# EAGLE design Controle_16_reles V2 (EAGLE 4.09)
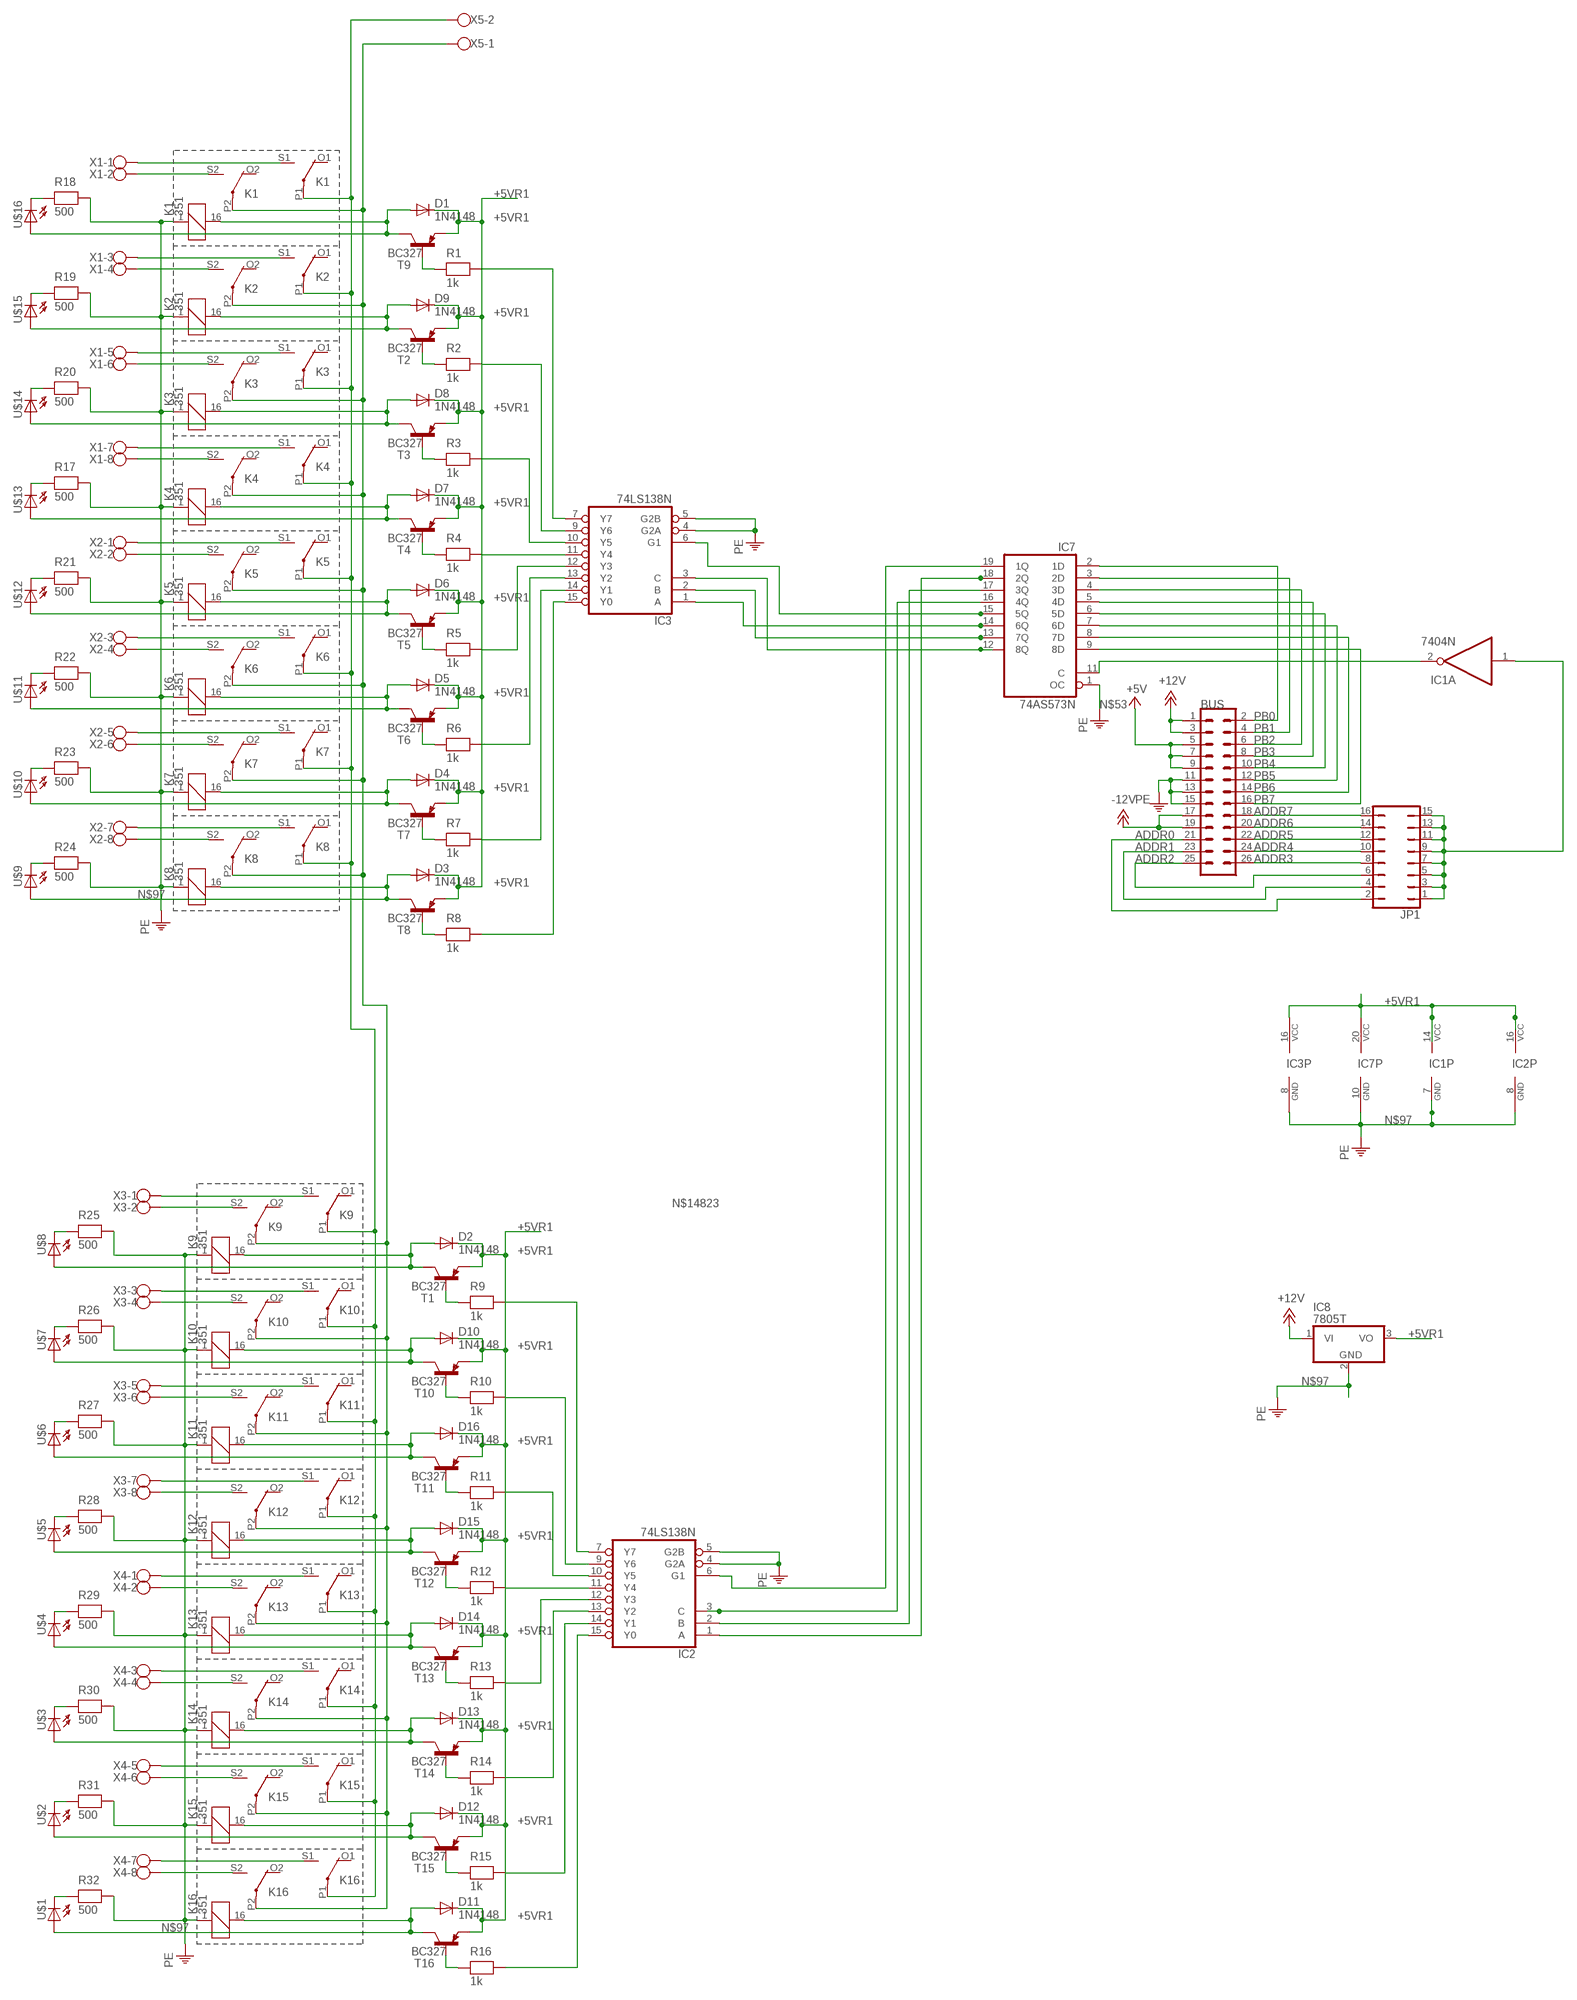
[diagram p0: schematic, sheet 1]

## Parts
BUS  ML26  [ML26]
D1  1N4148  [DO35-10]
D2  1N4148  [DO35-10]
D3  1N4148  [DO35-10]
D4  1N4148  [DO35-10]
D5  1N4148  [DO35-10]
D6  1N4148  [DO35-10]
D7  1N4148  [DO35-10]
D8  1N4148  [DO35-10]
D9  1N4148  [DO35-10]
D10  1N4148  [DO35-10]
D11  1N4148  [DO35-10]
D12  1N4148  [DO35-10]
D13  1N4148  [DO35-10]
D14  1N4148  [DO35-10]
D15  1N4148  [DO35-10]
D16  1N4148  [DO35-10]
IC1  7404N  [DIL14]
IC2  74LS138N  [DIL16]
IC3  74LS138N  [DIL16]
IC7  74AS573N  [DIL20]
IC8  7805T  [TO220H]
JP1  JP8Q  [JP8Q]
K1  351  [351]
K2  351  [351]
K3  351  [351]
K4  351  [351]
K5  351  [351]
K6  351  [351]
K7  351  [351]
K8  351  [351]
K9  351  [351]
K10  351  [351]
K11  351  [351]
K12  351  [351]
K13  351  [351]
K14  351  [351]
K15  351  [351]
K16  351  [351]
R1  1k  RESEU-10  [R-10]
R2  1k  RESEU-10  [R-10]
R3  1k  RESEU-10  [R-10]
R4  1k  RESEU-10  [R-10]
R5  1k  RESEU-10  [R-10]
R6  1k  RESEU-10  [R-10]
R7  1k  RESEU-10  [R-10]
R8  1k  RESEU-10  [R-10]
R9  1k  RESEU-10  [R-10]
R10  1k  RESEU-10  [R-10]
R11  1k  RESEU-10  [R-10]
R12  1k  RESEU-10  [R-10]
R13  1k  RESEU-10  [R-10]
R14  1k  RESEU-10  [R-10]
R15  1k  RESEU-10  [R-10]
R16  1k  RESEU-10  [R-10]
R17  500  RESEU-10  [R-10]
R18  500  RESEU-10  [R-10]
R19  500  RESEU-10  [R-10]
R20  500  RESEU-10  [R-10]
R21  500  RESEU-10  [R-10]
R22  500  RESEU-10  [R-10]
R23  500  RESEU-10  [R-10]
R24  500  RESEU-10  [R-10]
R25  500  RESEU-10  [R-10]
R26  500  RESEU-10  [R-10]
R27  500  RESEU-10  [R-10]
R28  500  RESEU-10  [R-10]
R29  500  RESEU-10  [R-10]
R30  500  RESEU-10  [R-10]
R31  500  RESEU-10  [R-10]
R32  500  RESEU-10  [R-10]
T1  BC327  [TO92]
T2  BC327  [TO92]
T3  BC327  [TO92]
T4  BC327  [TO92]
T5  BC327  [TO92]
T6  BC327  [TO92]
T7  BC327  [TO92]
T8  BC327  [TO92]
T9  BC327  [TO92]
T10  BC327  [TO92]
T11  BC327  [TO92]
T12  BC327  [TO92]
T13  BC327  [TO92]
T14  BC327  [TO92]
T15  BC327  [TO92]
T16  BC327  [TO92]
U$1  LED3MM  [LED3MM]
U$2  LED3MM  [LED3MM]
U$3  LED3MM  [LED3MM]
U$4  LED3MM  [LED3MM]
U$5  LED3MM  [LED3MM]
U$6  LED3MM  [LED3MM]
U$7  LED3MM  [LED3MM]
U$8  LED3MM  [LED3MM]
U$9  LED3MM  [LED3MM]
U$10  LED3MM  [LED3MM]
U$11  LED3MM  [LED3MM]
U$12  LED3MM  [LED3MM]
U$13  LED3MM  [LED3MM]
U$14  LED3MM  [LED3MM]
U$15  LED3MM  [LED3MM]
U$16  LED3MM  [LED3MM]
X1  AK500/8  [AK500/8]
X2  AK500/8  [AK500/8]
X3  AK500/8  [AK500/8]
X4  AK500/8  [AK500/8]
X5  AK300/2  [AK300/2]

## Nets
+5V: BUS.5 BUS.7 BUS.9
+5VR1: D1.C D2.C D3.C D4.C D5.C D6.C D7.C D8.C D9.C D10.C D11.C D12.C D13.C D14.C D15.C D16.C IC1.14(P:VCC) IC2.16(VCC) IC3.16(VCC) IC7.20(VCC) IC8.3(VO) T1.1(E) T2.1(E) T3.1(E) T4.1(E) T5.1(E) T6.1(E) T7.1(E) T8.1(E) T9.1(E) T10.1(E) T11.1(E) T12.1(E) T13.1(E) T14.1(E) T15.1(E) T16.1(E)
+12V: BUS.1 BUS.3 IC8.1(VI)
-12V: BUS.17 BUS.19
ADDR0: BUS.21 JP1.2
ADDR1: BUS.23 JP1.4
ADDR2: BUS.25 JP1.6
ADDR3: BUS.26 JP1.8
ADDR4: BUS.24 JP1.10
ADDR5: BUS.22 JP1.12
ADDR6: BUS.20 JP1.14
ADDR7: BUS.18 JP1.16
N$1: R9.1 T1.2(B)
N$2: R5.1 T5.2(B)
N$3: IC3.7(Y7) R1.2
N$4: IC3.9(Y6) R2.2
N$5: IC3.10(Y5) R3.2
N$6: IC3.11(Y4) R4.2
N$7: IC3.15(Y0) R8.2
N$8: IC3.14(Y1) R7.2
N$9: IC3.13(Y2) R6.2
N$10: R1.1 T9.2(B)
N$11: IC3.1(A) IC7.14(6Q)
N$12: IC3.2(B) IC7.13(7Q)
N$13: IC3.3(C) IC7.12(8Q)
N$14: IC3.6(G1) IC7.15(5Q)
N$15: D6.A K5.16 T5.3(C) U$12.A
N$16: IC2.3(C) IC7.16(4Q)
N$17: R2.1 T2.2(B)
N$18: D1.A K1.16 T9.3(C) U$16.A
N$19: D9.A K2.16 T2.3(C) U$15.A
N$20: R6.1 T6.2(B)
N$21: R3.1 T3.2(B)
N$22: D8.A K3.16 T3.3(C) U$14.A
N$23: D5.A K6.16 T6.3(C) U$11.A
N$24: R4.1 T4.2(B)
N$25: D7.A K4.16 T4.3(C) U$13.A
N$26: R7.1 T7.2(B)
N$27: D4.A K7.16 T7.3(C) U$10.A
N$28: R8.1 T8.2(B)
N$29: D3.A K8.16 T8.3(C) U$9.A
N$30: IC3.12(Y3) R5.2
N$32: IC2.2(B) IC7.17(3Q)
N$33: IC1.1(A:I) JP1.1 JP1.3 JP1.5 JP1.7 JP1.9 JP1.11 JP1.13 JP1.15
N$34: IC2.1(A) IC7.18(2Q)
N$35: K1.S1(2:S) X1.1
N$36: K1.S2(3:S) X1.2
N$37: K2.S1(2:S) X1.3
N$38: K2.S2(3:S) X1.4
N$39: K3.S1(2:S) X1.5
N$40: K3.S2(3:S) X1.6
N$41: K4.S1(2:S) X1.7
N$42: K4.S2(3:S) X1.8
N$43: K5.S1(2:S) X2.1
N$44: K5.S2(3:S) X2.2
N$45: K6.S1(2:S) X2.3
N$46: K6.S2(3:S) X2.4
N$47: K7.S1(2:S) X2.5
N$48: K7.S2(3:S) X2.6
N$49: K8.S1(2:S) X2.7
N$50: K8.S2(3:S) X2.8
N$51: R18.1 U$16.K(C)
N$52: D2.A K9.16 T1.3(C) U$8.A
N$53: IC1.2(A:O) IC7.11(C)
N$54: R10.1 T10.2(B)
N$55: D10.A K10.16 T10.3(C) U$7.A
N$56: R11.1 T11.2(B)
N$57: D16.A K11.16 T11.3(C) U$6.A
N$58: R12.1 T12.2(B)
N$60: D15.A K12.16 T12.3(C) U$5.A
N$61: R13.1 T13.2(B)
N$62: D14.A K13.16 T13.3(C) U$4.A
N$63: R14.1 T14.2(B)
N$64: D13.A K14.16 T14.3(C) U$3.A
N$65: R15.1 T15.2(B)
N$66: D12.A K15.16 T15.3(C) U$2.A
N$67: R16.1 T16.2(B)
N$68: D11.A K16.16 T16.3(C) U$1.A
N$69: IC2.7(Y7) R9.2
N$70: IC2.9(Y6) R10.2
N$71: IC2.10(Y5) R11.2
N$72: IC2.11(Y4) R12.2
N$73: IC2.15(Y0) R16.2
N$74: IC2.14(Y1) R15.2
N$75: IC2.13(Y2) R14.2
N$76: IC2.12(Y3) R13.2
N$77: IC2.6(G1) IC7.19(1Q)
N$78: K9.S1(2:S) X3.1
N$79: K9.S2(3:S) X3.2
N$80: K10.S1(2:S) X3.3
N$81: K10.S2(3:S) X3.4
N$82: K11.S1(2:S) X3.5
N$83: K11.S2(3:S) X3.6
N$84: K12.S1(2:S) X3.7
N$85: K12.S2(3:S) X3.8
N$86: K13.S1(2:S) X4.1
N$87: K13.S2(3:S) X4.2
N$88: K14.S1(2:S) X4.3
N$89: K14.S2(3:S) X4.4
N$90: K15.S1(2:S) X4.5
N$91: K15.S2(3:S) X4.6
N$92: K16.S1(2:S) X4.7
N$93: K16.S2(3:S) X4.8
N$94: R20.1 U$14.K(C)
N$95: R19.1 U$15.K(C)
N$96: R32.1 U$1.K(C)
N$97: BUS.11 BUS.13 BUS.15 IC1.7(P:GND) IC2.4(G2A) IC2.5(G2B) IC2.8(GND) IC3.4(G2A) IC3.5(G2B) IC3.8(GND) IC7.1(OC) IC7.10(GND) IC8.2(GND) K1.1 K2.1 K3.1 K4.1 K5.1 K6.1 K7.1 K8.1 K9.1 K10.1 K11.1 K12.1 K13.1 K14.1 K15.1 K16.1 R17.2 R18.2 R19.2 R20.2 R21.2 R22.2 R23.2 R24.2 R25.2 R26.2 R27.2 R28.2 R29.2 R30.2 R31.2 R32.2 ; supply symbol labelled PE
N$98: R17.1 U$13.K(C)
N$148: K1.P1(2:P) K2.P1(2:P) K3.P1(2:P) K4.P1(2:P) K5.P1(2:P) K6.P1(2:P) K7.P1(2:P) K8.P1(2:P) K9.P1(2:P) K10.P1(2:P) K11.P1(2:P) K12.P1(2:P) K13.P1(2:P) K14.P1(2:P) K15.P1(2:P) K16.P1(2:P) X5.2
N$150: R21.1 U$12.K(C)
N$153: R22.1 U$11.K(C)
N$156: R23.1 U$10.K(C)
N$160: R24.1 U$9.K(C)
N$163: R25.1 U$8.K(C)
N$165: R26.1 U$7.K(C)
N$169: R27.1 U$6.K(C)
N$171: R28.1 U$5.K(C)
N$174: R29.1 U$4.K(C)
N$177: R30.1 U$3.K(C)
N$180: R31.1 U$2.K(C)
N$14823: K1.P2(3:P) K2.P2(3:P) K3.P2(3:P) K4.P2(3:P) K5.P2(3:P) K6.P2(3:P) K7.P2(3:P) K8.P2(3:P) K9.P2(3:P) K10.P2(3:P) K11.P2(3:P) K12.P2(3:P) K13.P2(3:P) K14.P2(3:P) K15.P2(3:P) K16.P2(3:P) X5.1
PB0: BUS.2 IC7.2(1D)
PB1: BUS.4 IC7.3(2D)
PB2: BUS.6 IC7.4(3D)
PB3: BUS.8 IC7.5(4D)
PB4: BUS.10 IC7.6(5D)
PB5: BUS.12 IC7.7(6D)
PB6: BUS.14 IC7.8(7D)
PB7: BUS.16 IC7.9(8D)
Unconnected: IC1.3(B:I) IC1.4(B:O) IC1.5(C:I) IC1.6(C:O) IC1.8(D:O) IC1.9(D:I) IC1.10(E:O) IC1.11(E:I) IC1.12(F:O) IC1.13(F:I) K1.O1(2:O) K1.O2(3:O) K2.O1(2:O) K2.O2(3:O) K3.O1(2:O) K3.O2(3:O) K4.O1(2:O) K4.O2(3:O) K5.O1(2:O) K5.O2(3:O) K6.O1(2:O) K6.O2(3:O) K7.O1(2:O) K7.O2(3:O) K8.O1(2:O) K8.O2(3:O) K9.O1(2:O) K9.O2(3:O) K10.O1(2:O) K10.O2(3:O) K11.O1(2:O) K11.O2(3:O) K12.O1(2:O) K12.O2(3:O) K13.O1(2:O) K13.O2(3:O) K14.O1(2:O) K14.O2(3:O) K15.O1(2:O) K15.O2(3:O) K16.O1(2:O) K16.O2(3:O)

## Library data of the parts
BUS = con-harting-ml:ML26: HARTING
D1-D16 = diode:1N4148: DIODE high speed (Philips)
IC1 = 74xx-us:74*04: Hex INVERTER
IC2 IC3 = 74xx-us:74*138: 3-line to 8-line DECODER/DEMULTIPLEXER
IC7 = 74xx-us:74*573: 8-bit D latch BUS DRIVER
IC8 = linear:78*: Positive VOLTAGE REGULATOR
JP1 = jumper:JP8Q: JUMPER
K1-K16 = relay:351: RELAY 2 x switch, Omron
R1-R32 = discrete:RESEU-10
T1-T16 = transistor-pnp:BC327: PNP Transistor
U$1-U$16 = led:LED: LED
X1-X4 = con-ptr500:AK500/8: CONNECTOR
X5 = con-ptr500:AK300/2: CONNECTOR

## Board
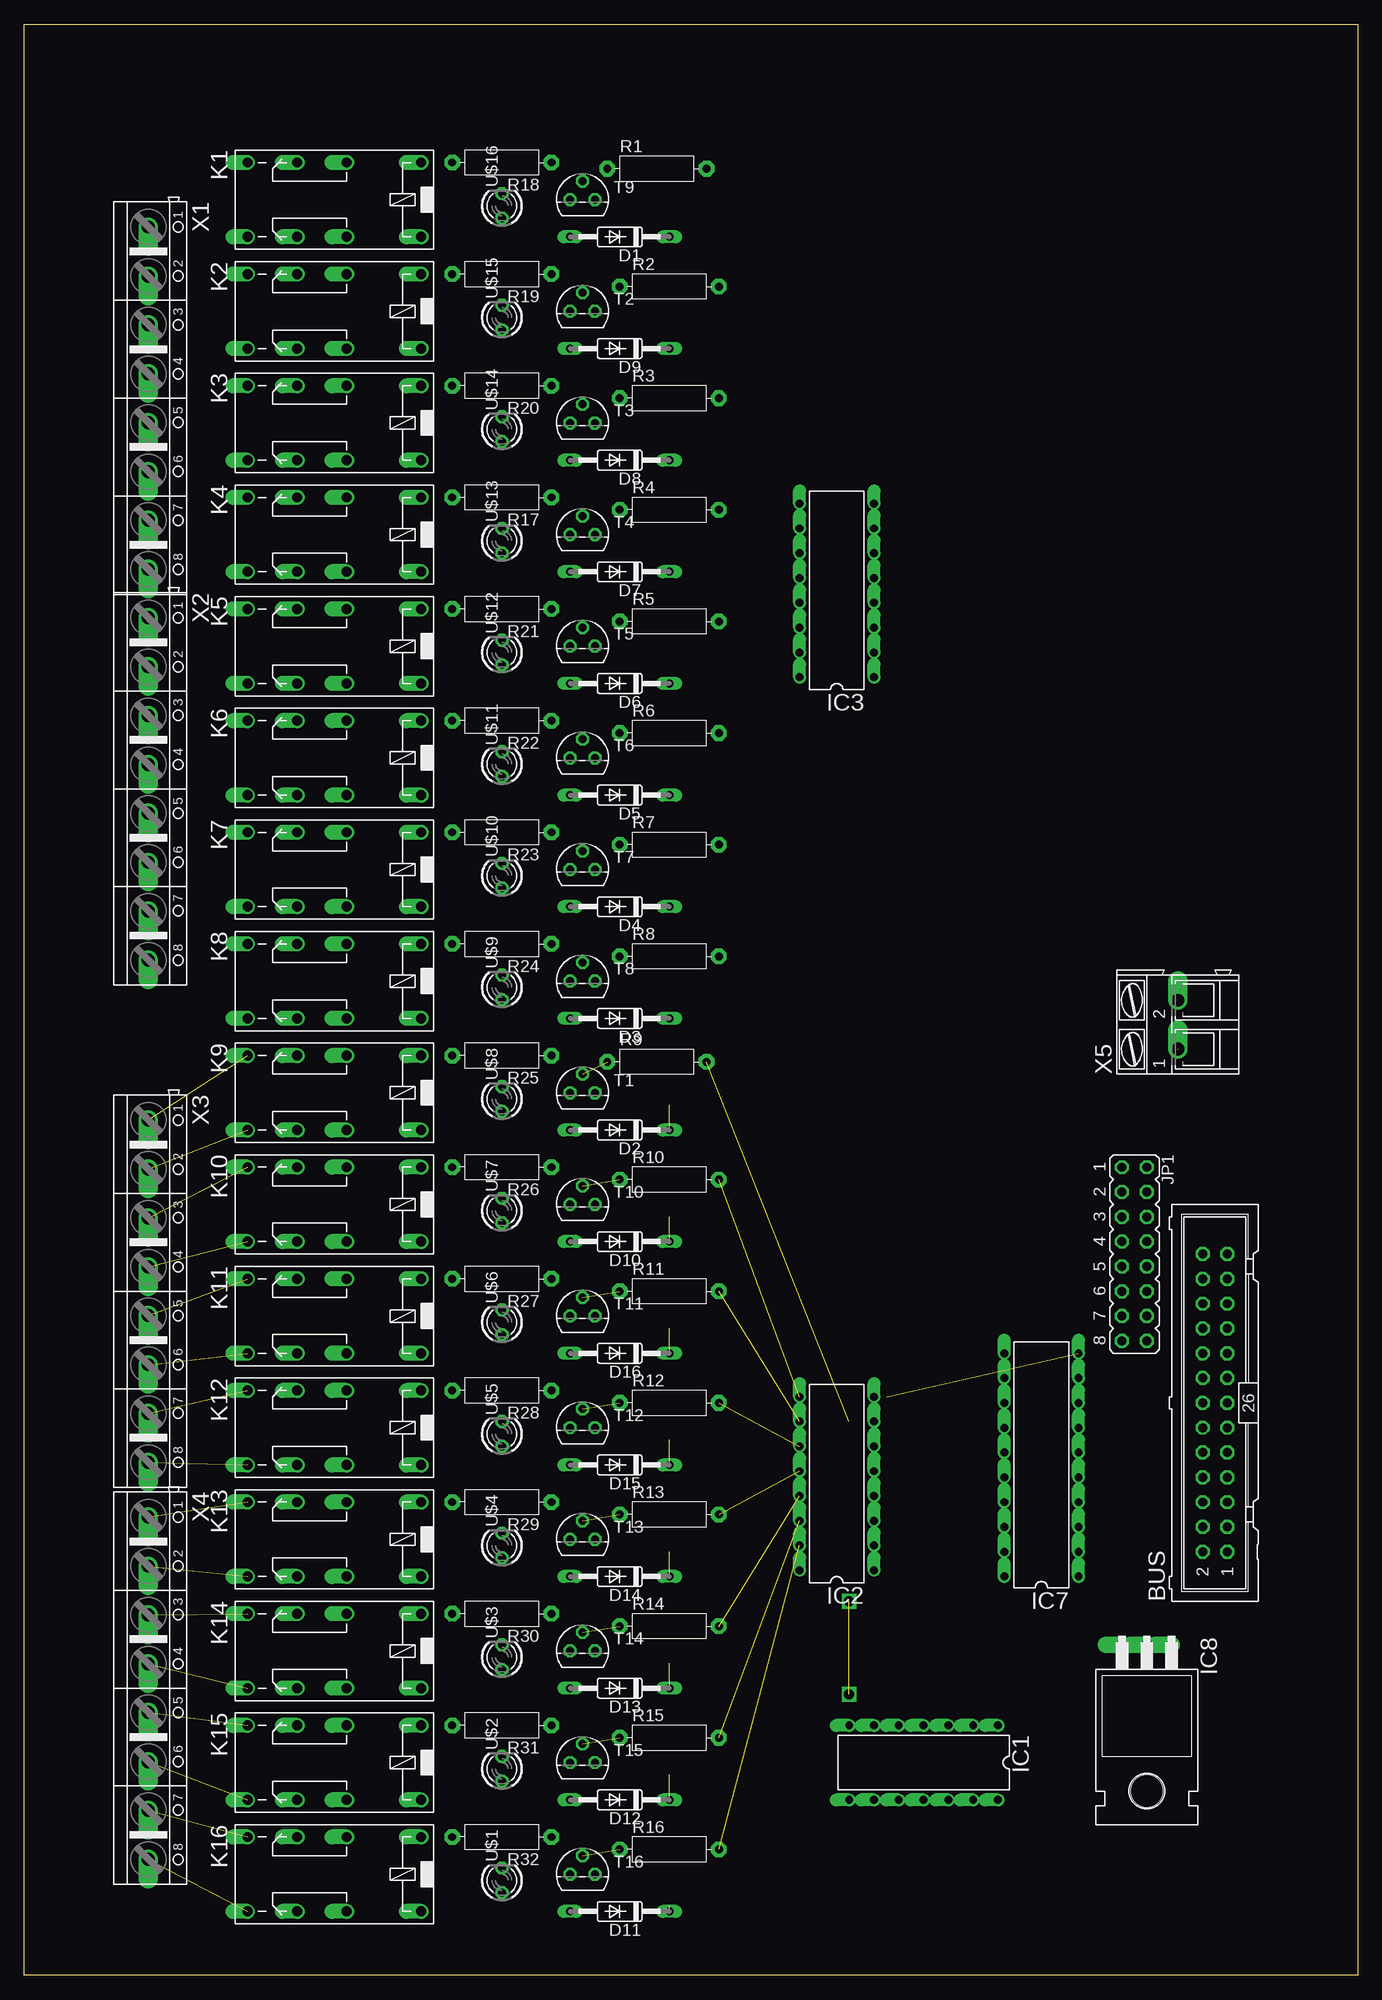
[diagram p1: board, top side]
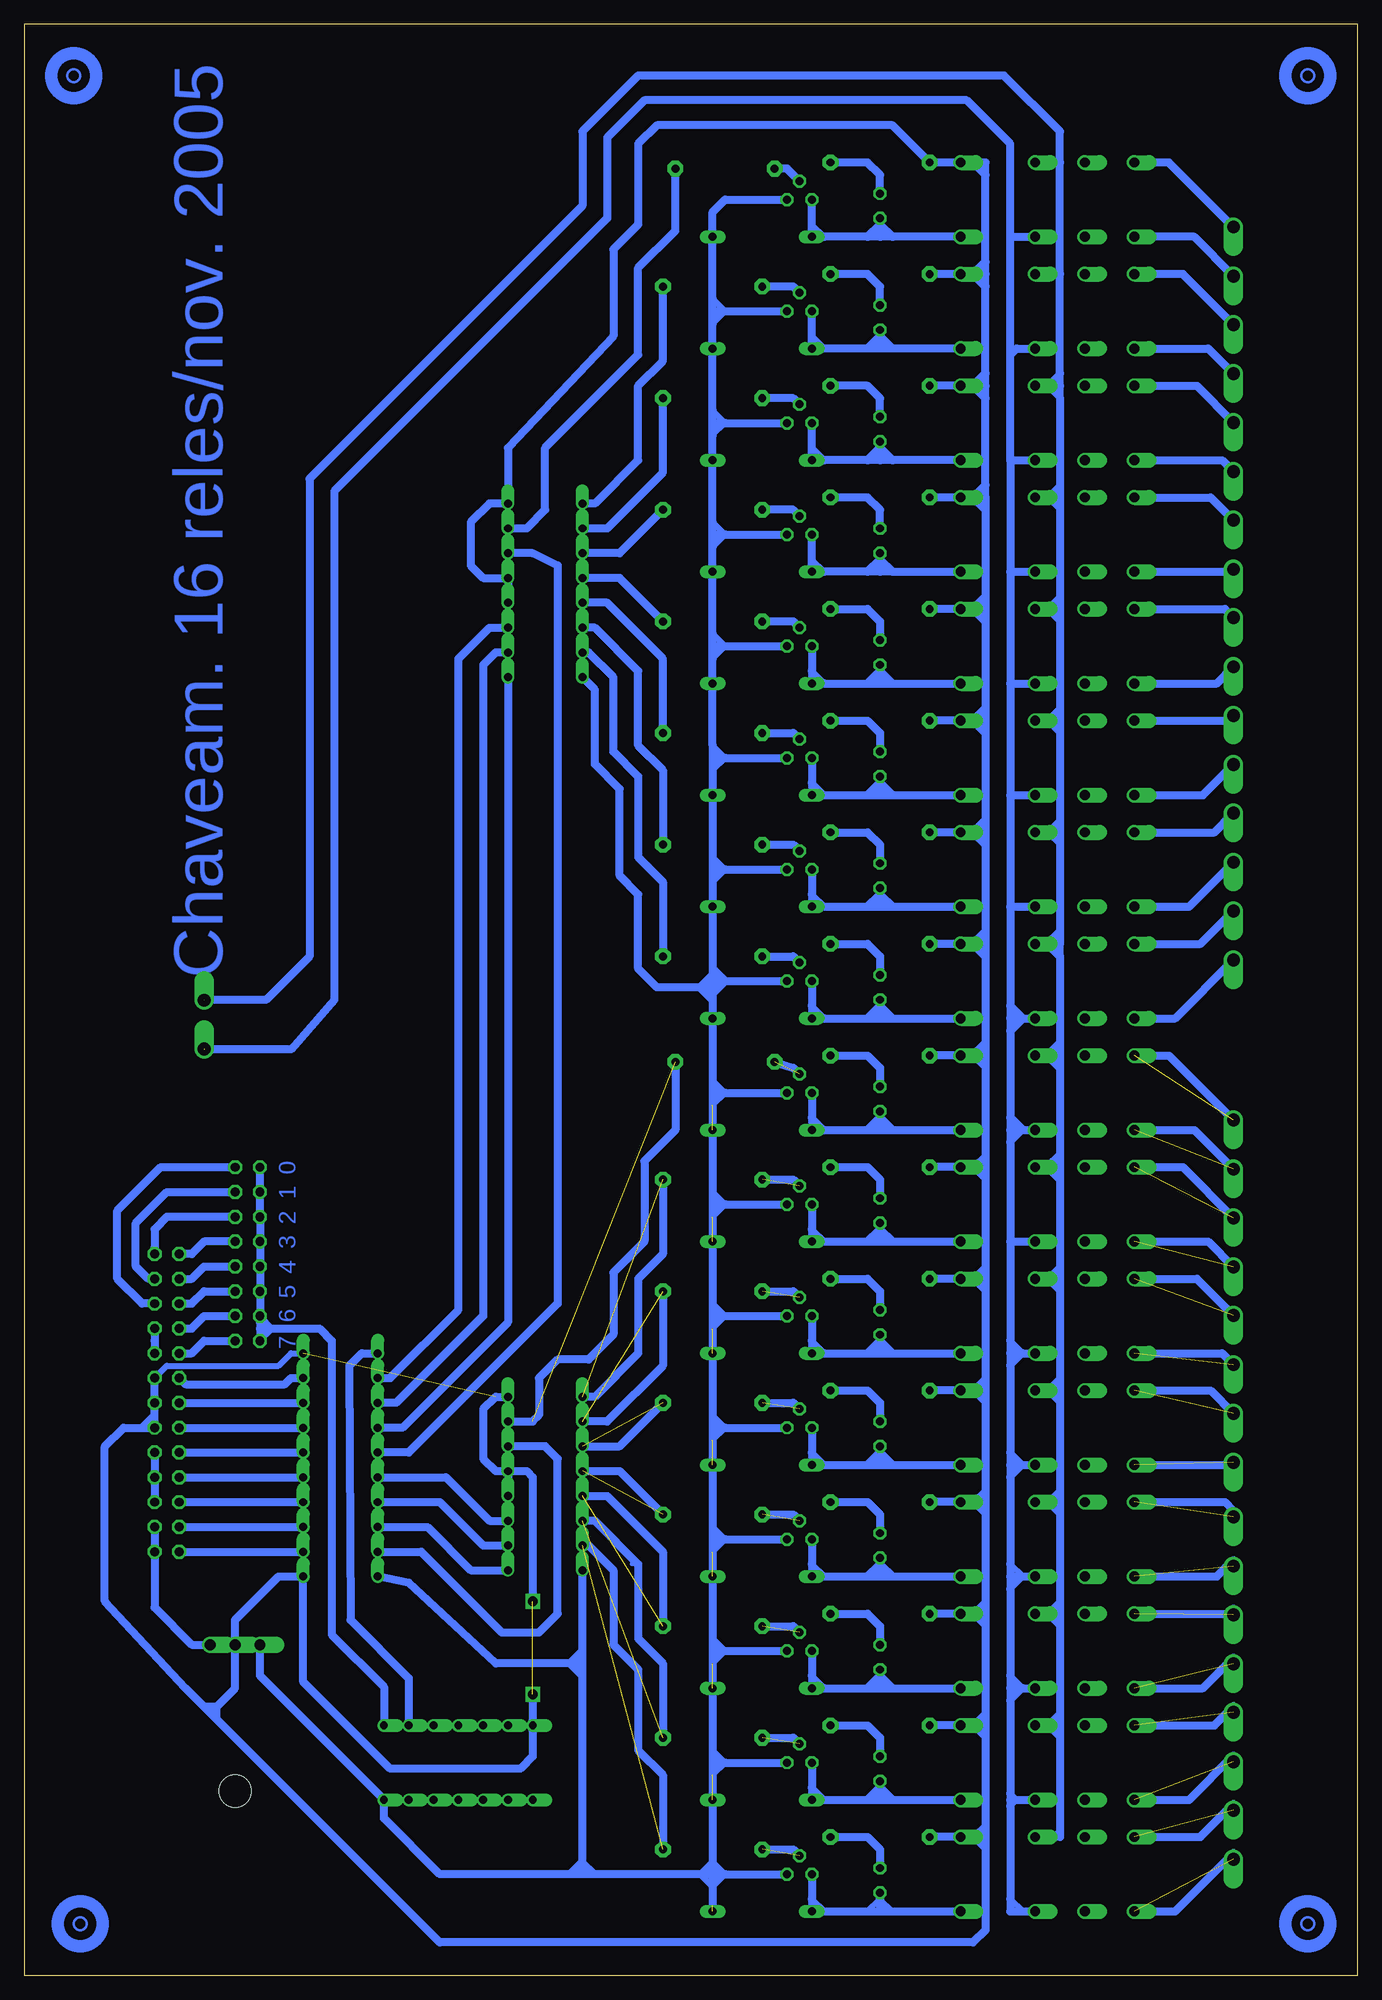
[diagram p2: board, bottom side, seen from below]

Size 136.5 x 199.72 mm. Coordinates in mm from the lower left corner, seen from the top.
Outline: 0,199.72 136.5,199.72 136.5,0 0,0 0,199.72
Copper layers used: Bottom

### Footprints (pad centres in the part's own frame; a part is rotated, then mirrored left to right if it is on the bottom)
ML26 = drill 0.914 octagon: 1 -15.24,-1.27; 2 -15.24,1.27; 3 -12.7,-1.27; 4 -12.7,1.27; 5 -10.16,-1.27; 6 -10.16,1.27; 7 -7.62,-1.27; 8 -7.62,1.27; 9 -5.08,-1.27; 10 -5.08,1.27; 11 -2.54,-1.27; 12 -2.54,1.27; 13 0,-1.27; 14 0,1.27; 15 2.54,-1.27; 16 2.54,1.27; 17 5.08,-1.27; 18 5.08,1.27; 19 7.62,-1.27; 20 7.62,1.27; 21 10.16,-1.27; 22 10.16,1.27; 23 12.7,-1.27; 24 12.7,1.27; 25 15.24,-1.27; 26 15.24,1.27
DO35-10 = drill 0.813 long: A 5.08,0; C -5.08,0
DIL14 = drill 0.8 offset: 1 -7.62,-3.81; 2 -5.08,-3.81; 3 -2.54,-3.81; 4 0,-3.81; 5 2.54,-3.81; 6 5.08,-3.81; 7 7.62,-3.81; 8 7.62,3.81; 9 5.08,3.81; 10 2.54,3.81; 11 0,3.81; 12 -2.54,3.81; 13 -5.08,3.81; 14 -7.62,3.81
DIL16 = drill 0.813 offset: 1 -8.89,-3.81; 2 -6.35,-3.81; 3 -3.81,-3.81; 4 -1.27,-3.81; 5 1.27,-3.81; 6 3.81,-3.81; 7 6.35,-3.81; 8 8.89,-3.81; 9 8.89,3.81; 10 6.35,3.81; 11 3.81,3.81; 12 1.27,3.81; 13 -1.27,3.81; 14 -3.81,3.81; 15 -6.35,3.81; 16 -8.89,3.81
DIL20 = drill 0.813 offset: 1 -11.43,-3.81; 2 -8.89,-3.81; 3 -6.35,-3.81; 4 -3.81,-3.81; 5 -1.27,-3.81; 6 1.27,-3.81; 7 3.81,-3.81; 8 6.35,-3.81; 9 8.89,-3.81; 10 11.43,-3.81; 11 11.43,3.81; 12 8.89,3.81; 13 6.35,3.81; 14 3.81,3.81; 15 1.27,3.81; 16 -1.27,3.81; 17 -3.81,3.81; 18 -6.35,3.81; 19 -8.89,3.81; 20 -11.43,3.81
TO220H = drill 1.118 offset: 1 -2.54,-10.16; 2 0,-10.16; 3 2.54,-10.16 | hole 3.302: 0,4.826
JP8Q = drill 0.914 octagon: 1 -8.89,-1.27; 2 -8.89,1.27; 3 -6.35,-1.27; 4 -6.35,1.27; 5 -3.81,-1.27; 6 -3.81,1.27; 7 -1.27,-1.27; 8 -1.27,1.27; 9 1.27,-1.27; 10 1.27,1.27; 11 3.81,-1.27; 12 3.81,1.27; 13 6.35,-1.27; 14 6.35,1.27; 15 8.89,-1.27; 16 8.89,1.27
351 = drill 1.016 offset: 1 -3.81,-3.81; 16 -3.81,3.81; O1 8.89,-3.81; O2 8.89,3.81; P1 3.81,-3.81; P2 3.81,3.81; S1 13.97,-3.81; S2 13.97,3.81
R-10 = drill 0.813 pad 1.6 octagon: 1 -5.08,0; 2 5.08,0
TO92 = drill 0.813 octagon: 1 1.27,0; 2 0,1.905; 3 -1.27,0
LED3MM = drill 0.813 octagon: A -1.27,0; K 1.27,0
AK500/8 = drill 1.321 offset: 1 -17.526,0; 2 -12.497,0; 3 -7.518,0; 4 -2.489,0; 5 2.489,0; 6 7.518,0; 7 12.497,0; 8 17.526,0
AK300/2 = drill 1.321 offset: 1 -2.515,0; 2 2.489,0

### Placement (x,y rotation side)
BUS  121.91,58.58 90 top
D1  60.95,177.96 180 top
D2  60.95,86.52 180 top
D3  60.95,97.95 180 top
D4  60.95,109.38 180 top
D5  60.95,120.81 180 top
D6  60.95,132.25 180 top
D7  60.95,143.68 180 top
D8  60.95,155.1 180 top
D9  60.95,166.53 180 top
D10  60.95,75.09 180 top
D11  60.95,6.52 180 top
D12  60.95,17.94 180 top
D13  60.95,29.38 180 top
D14  60.95,40.8 180 top
D15  60.95,52.23 180 top
D16  60.95,63.66 180 top
IC1  92.07,21.75 180 top
IC2  83.18,50.33 90 top
IC3  83.18,141.77 90 top
IC7  104.13,52.23 90 top
IC8  114.93,23.66 180 top
JP1  113.66,73.82 270 top
K1  36.82,181.77 180 top
K2  36.82,170.34 180 top
K3  36.82,158.91 180 top
K4  36.82,147.49 180 top
K5  36.82,136.06 180 top
K6  36.82,124.62 180 top
K7  36.82,113.19 180 top
K8  36.82,101.77 180 top
K9  36.82,90.33 180 top
K10  36.82,78.91 180 top
K11  36.82,67.47 180 top
K12  36.82,56.04 180 top
K13  36.82,44.61 180 top
K14  36.82,33.19 180 top
K15  36.82,21.75 180 top
K16  36.82,10.33 180 top
R1  64.77,184.95 0 top
R2  66.03,172.88 0 top
R3  66.03,161.45 0 top
R4  66.03,150.03 0 top
R5  66.03,138.59 0 top
R6  66.03,127.16 0 top
R7  66.03,115.73 0 top
R8  66.03,104.3 0 top
R9  64.77,93.51 0 top
R10  66.03,81.44 0 top
R11  66.03,70.01 0 top
R12  66.03,58.58 0 top
R13  66.03,47.15 0 top
R14  66.03,35.72 0 top
R15  66.03,24.3 0 top
R16  66.03,12.86 0 top
R17  48.89,151.29 180 top
R18  48.89,185.58 180 top
R19  48.89,174.16 180 top
R20  48.89,162.72 180 top
R21  48.89,139.87 180 top
R22  48.89,128.44 180 top
R23  48.89,117 180 top
R24  48.89,105.57 180 top
R25  48.89,94.14 180 top
R26  48.89,82.72 180 top
R27  48.89,71.28 180 top
R28  48.89,59.85 180 top
R29  48.89,48.42 180 top
R30  48.89,36.99 180 top
R31  48.89,25.56 180 top
R32  48.89,14.13 180 top
T1  57.14,90.33 0 top
T2  57.14,170.34 0 top
T3  57.14,158.91 0 top
T4  57.14,147.49 0 top
T5  57.14,136.06 0 top
T6  57.14,124.62 0 top
T7  57.14,113.19 0 top
T8  57.14,101.77 0 top
T9  57.14,181.77 0 top
T10  57.14,78.91 0 top
T11  57.14,67.47 0 top
T12  57.14,56.04 0 top
T13  57.14,44.61 0 top
T14  57.14,33.19 0 top
T15  57.14,21.75 0 top
T16  57.14,10.33 0 top
U$1  48.89,9.69 90 top
U$2  48.89,21.12 90 top
U$3  48.89,32.55 90 top
U$4  48.89,43.98 90 top
U$5  48.89,55.41 90 top
U$6  48.89,66.84 90 top
U$7  48.89,78.27 90 top
U$8  48.89,89.7 90 top
U$9  48.89,101.13 90 top
U$10  48.89,112.56 90 top
U$11  48.89,123.99 90 top
U$12  48.89,135.42 90 top
U$13  48.89,146.85 90 top
U$14  48.89,158.28 90 top
U$15  48.89,169.71 90 top
U$16  48.89,181.14 90 top
X1  12.69,161.45 270 top
X2  12.69,121.45 270 top
X3  12.69,70.01 270 top
X4  12.69,29.38 270 top
X5  118.1,97.32 90 top

### Tracks (layer width: path | path; a pad name or v marks a point on that pad's centre or on a via)
+5V
  Bottom 0.813: BUS.5 BUS.7 BUS.9
+5VR1  (8 unrouted)
  Bottom 0.61: 66.03,31.91 64.77,33.19 66.03,34.45 | 66.03,45.88 64.77,44.61 66.03,43.34 | 66.03,57.31 64.77,56.04 66.03,54.77 | 66.03,68.75 64.77,67.47 66.03,66.2 | 66.03,80.17 64.77,78.91 66.03,77.63 | 66.03,23.02 64.77,21.75 66.03,20.48 | 66.03,91.6 64.77,90.33 66.03,89.06 | 66.03,123.35 64.77,124.62 66.03,125.89 | 66.03,137.32 64.77,136.06 66.03,134.78 | 66.03,148.75 64.77,147.49 66.03,146.22 | 66.03,160.19 64.77,158.91 66.03,157.64 | 66.03,171.62 64.77,170.34 66.03,169.07 | 66.03,114.47 64.77,113.19 66.03,111.92 | 66.03,11.59 64.77,10.33 66.03,9.05 67.3,10.33 66.03,11.59
  Bottom 0.813: 66.03,10.33 66.03,9.05 66.03,7.15 65.4,6.52 | 66.03,10.33 64.77,10.33 T16.1 | 66.03,21.75 66.03,20.48 66.03,11.59 66.03,10.33 | 66.03,21.75 64.77,21.75 T15.1 | 66.03,33.19 66.03,31.91 66.03,23.02 66.03,21.75 | 66.03,33.19 64.77,33.19 T14.1 | 66.03,44.61 66.03,43.34 66.03,34.45 66.03,33.19 | 66.03,44.61 64.77,44.61 T13.1 | 66.03,56.04 66.03,54.77 66.03,45.88 66.03,44.61 | 66.03,56.04 64.77,56.04 T12.1 | 66.03,67.47 66.03,66.2 66.03,57.31 66.03,56.04 | 66.03,67.47 64.77,67.47 T11.1 | 66.03,78.91 66.03,77.63 66.03,68.75 66.03,67.47 | 66.03,78.91 64.77,78.91 T10.1 | 66.03,90.33 66.03,89.06 66.03,80.17 66.03,78.91 | 66.03,90.33 64.77,90.33 T1.1 | 66.03,90.33 66.03,91.6 D3.C 66.03,99.86 | 66.03,10.33 67.3,10.33 79.37,10.33 | 66.03,113.19 66.03,111.92 D4.C 66.03,103.03 | 66.03,113.19 64.77,113.19 T7.1 | 66.03,124.62 66.03,123.35 D5.C 66.03,114.47 66.03,113.19 | 66.03,124.62 64.77,124.62 T6.1 | 66.03,136.06 66.03,134.78 D6.C 66.03,125.89 66.03,124.62 | 66.03,136.06 64.77,136.06 T5.1 | 66.03,147.49 66.03,146.22 D7.C 66.03,137.32 66.03,136.06 | 66.03,147.49 64.77,147.49 T4.1 | 66.03,158.91 66.03,157.64 D8.C 66.03,148.75 66.03,147.49 | 66.03,158.91 64.77,158.91 T3.1 | 66.03,170.34 66.03,169.07 D9.C 66.03,160.19 66.03,158.91 | 66.03,170.34 64.77,170.34 T2.1 | 66.03,170.34 66.03,171.62 D1.C 66.03,180.5 64.77,181.77 T9.1 | 64.77,101.77 66.03,101.77 | 64.77,101.77 T8.1 | 66.03,101.77 66.03,101.13 | 66.03,100.49 66.03,101.13 | 66.03,100.49 66.03,99.86 | 66.03,103.03 66.03,102.4 | 66.03,102.4 66.03,101.77 | 66.03,103.03 64.77,101.77 | 64.77,101.77 66.03,100.49 | IC3.16 78.1,131.61 78.1,123.99 75.56,121.45 75.56,112.56 73.66,110.66 73.66,103.03 71.75,101.13 67.3,101.13
  Bottom 0.813: 67.3,101.13 66.03,101.13 | 66.03,102.4 67.3,101.13 | 67.3,101.13 66.03,99.86 | IC7.20 97.15,40.17 88.26,31.91 80.64,31.91 | 79.37,31.91 80.64,31.91 | 79.37,31.91 79.37,33.19 | 79.37,33.19 IC2.16 | 79.37,10.33 79.37,11.47 | 79.37,11.47 79.37,11.59 | 79.37,11.59 79.37,30.64 | 79.37,30.64 79.37,31.91 | 79.37,10.33 80.64,10.33 | 80.64,10.33 93.97,10.33 99.69,16.04 IC1.14 112.39,30.64 IC8.3 | 79.37,11.47 78.35,10.45 | 80.64,10.33 79.37,11.59 | 80.64,31.91 79.37,33.19 | 79.37,30.64 80.64,31.91
+12V
  Bottom 0.813: BUS.3 BUS.1 123.19,37.63 119.38,33.82 IC8.1
-12V
  Bottom 0.813: BUS.17 123.19,64.94 BUS.19
ADDR0
  Bottom 0.813: BUS.21 124.45,68.75 127,71.28 127,78.27 122.55,82.72 JP1.2
ADDR1
  Bottom 0.813: BUS.23 123.82,71.28 125.09,72.55 125.09,77 121.91,80.17 JP1.4
ADDR2
  Bottom 0.813: 123.19,74.46 BUS.25 123.19,76.36 121.91,77.63 JP1.6
ADDR3
  Bottom 0.813: BUS.26 119.38,73.82 118.1,75.09 JP1.8
ADDR4
  Bottom 0.813: BUS.24 119.38,71.28 118.1,72.55 JP1.10
ADDR5
  Bottom 0.813: BUS.22 119.38,68.75 118.1,70.01 JP1.12
ADDR6
  Bottom 0.813: BUS.20 119.38,66.2 118.1,67.47 JP1.14
ADDR7
  Bottom 0.813: BUS.18 119.38,63.66 118.1,64.94 JP1.16
N$1  (1 unrouted)
N$2
  Bottom 0.813: R5.1 57.78,138.59 T5.2
N$3
  Bottom 0.813: R1.2 69.84,178.6 73.66,174.79 73.66,165.9 83.18,156.38 83.18,150.03 85.08,148.12 IC3.7
N$4
  Bottom 0.813: IC3.9 78.1,150.66 73.66,155.1 73.66,162.72 71.11,165.26 R2.2
N$5
  Bottom 0.813: IC3.10 76.83,148.12 71.11,153.83 R3.2
N$6
  Bottom 0.813: IC3.11 75.56,145.58 R4.2
N$7
  Bottom 0.813: R8.2 71.11,111.92 73.66,114.47 73.66,122.72 76.19,125.26 76.19,132.88 78.73,135.42 IC3.15
N$8
  Bottom 0.813: R7.2 71.11,123.35 73.66,125.89 73.66,133.51 78.1,137.96 IC3.14
N$9
  Bottom 0.813: IC3.13 76.83,140.5 71.11,134.78 R6.2
N$10
  Bottom 0.813: R1.1 58.41,184.95 T9.2
N$11
  Bottom 0.813: IC3.1 86.99,66.84 97.78,56.04 IC7.14
N$12
  Bottom 0.813: IC3.2 88.26,135.42 89.53,134.15 89.53,67.47 98.42,58.58 IC7.13
N$13
  Bottom 0.813: IC3.3 88.89,137.96 92.07,134.78 92.07,68.11 99.05,61.12 IC7.12
N$14
  Bottom 0.813: IC3.6 84.45,145.58 81.91,144.31 81.91,68.75 97.15,53.5 IC7.15
N$15
  Bottom 0.61: 55.88,133.51 54.6,132.25
  Bottom 0.813: T5.3 55.88,133.51 D6.A 54.6,132.25 50.16,132.25 | 50.16,132.25 48.89,132.25 | 48.89,132.25 47.62,132.25 | 47.62,132.25 K5.16 | 48.89,133.51 U$12.A | 48.89,132.25 48.89,133.51 | 50.16,132.25 48.89,133.51 | 48.89,133.51 47.62,132.25
N$16
  Bottom 0.813: IC2.3 88.89,46.52 93.34,50.96 IC7.16
N$17
  Bottom 0.813: R2.1 57.78,172.88 T2.2
N$18
  Bottom 0.61: 54.6,177.96 55.88,179.24
  Bottom 0.813: T9.3 55.88,179.24 D1.A 54.6,177.96 50.16,177.96 | K1.16 47.62,177.96 | 47.62,177.96 48.89,177.96 | 48.89,177.96 50.16,177.96 | 48.89,179.24 U$16.A | 48.89,177.96 48.89,179.24 | 48.89,179.24 50.16,177.96 | 47.62,177.96 48.89,179.24
N$19
  Bottom 0.61: 54.6,166.53 55.88,167.81
  Bottom 0.813: T2.3 55.88,167.81 D9.A 54.6,166.53 50.16,166.53 | K2.16 47.62,166.53 | 47.62,166.53 48.89,166.53 | 48.89,166.53 50.16,166.53 | 48.89,167.81 U$15.A | 48.89,166.53 48.89,167.81 | 48.89,167.81 50.16,166.53 | 47.62,166.53 48.89,167.81
N$20
  Bottom 0.813: R6.1 57.78,127.16 T6.2
N$21
  Bottom 0.813: R3.1 57.78,161.45 T3.2
N$22
  Bottom 0.61: 54.6,155.1 55.88,156.38
  Bottom 0.813: T3.3 55.88,156.38 D8.A 54.6,155.1 50.16,155.1 | K3.16 47.62,155.1 | 47.62,155.1 48.89,155.1 | 48.89,155.1 50.16,155.1 | 48.89,156.38 U$14.A | 48.89,155.1 48.89,156.38 | 48.89,156.38 50.16,155.1 | 47.62,155.1 48.89,156.38
N$23
  Bottom 0.61: 55.88,122.08 54.6,120.81
  Bottom 0.813: 50.16,120.81 54.6,120.81 D5.A 55.88,122.08 T6.3 | 50.16,120.81 48.89,120.81 | 48.89,120.81 47.62,120.81 | 47.62,120.81 K6.16 | 48.89,122.08 U$11.A | 48.89,120.81 48.89,122.08 | 50.16,120.81 48.89,122.08 | 48.89,122.08 47.62,120.81
N$24
  Bottom 0.813: R4.1 57.78,150.03 T4.2
N$25
  Bottom 0.61: 54.6,143.68 55.88,144.94
  Bottom 0.813: T4.3 55.88,144.94 D7.A 54.6,143.68 50.16,143.68 | 47.62,143.68 K4.16 | 47.62,143.68 48.89,143.68 | 48.89,143.68 50.16,143.68 | 48.89,144.94 U$13.A | 48.89,143.68 48.89,144.94 | 48.89,144.94 50.16,143.68 | 47.62,143.68 48.89,144.94
N$26
  Bottom 0.813: R7.1 57.78,115.73 T7.2
N$27
  Bottom 0.61: 55.88,110.66 54.6,109.38
  Bottom 0.813: T7.3 55.88,110.66 D4.A 54.6,109.38 50.16,109.38 | 50.16,109.38 48.89,109.38 | 48.89,109.38 47.62,109.38 | 47.62,109.38 K7.16 | 48.89,110.66 U$10.A | 48.89,109.38 48.89,110.66 | 50.16,109.38 48.89,110.66 | 48.89,110.66 47.62,109.38
N$28
  Bottom 0.813: R8.1 57.78,104.3 T8.2
N$29
  Bottom 0.61: 55.88,99.22 54.6,97.95
  Bottom 0.813: T8.3 55.88,99.22 D3.A 54.6,97.95 50.16,97.95 | 50.16,97.95 48.89,97.95 | 48.89,97.95 47.62,97.95 | 47.62,97.95 K8.16 | 48.89,99.22 U$9.A | 48.89,97.95 48.89,99.22 | 50.16,97.95 48.89,99.22 | 48.89,99.22 47.62,97.95
N$30
  Bottom 0.813: IC3.12 75.56,143.04 R5.2
N$32
  Bottom 0.813: IC2.2 89.53,43.98 93.97,48.42 IC7.17
N$33
  Bottom 0.61: 111.75,65.57 JP1.15 | 111.12,66.2 111.75,66.2 | 111.75,66.2 112.39,66.2 | 112.39,66.84 111.75,66.2 | JP1.13 111.12,66.2 | 111.12,66.2 111.75,65.57 | 111.75,66.2 111.75,65.57
  Bottom 0.813: JP1.1 JP1.3 JP1.5 JP1.7 JP1.9 JP1.11 JP1.13 112.39,66.84 112.39,66.2 JP1.15 | 111.12,66.2 106.29,66.2 105.02,64.94 105.02,34.84 99.69,29.5 IC1.1
N$34
  Bottom 0.813: IC2.1 90.8,41.44 95.25,45.88 IC7.18
N$35
  Bottom 0.813: X1.1 19.3,185.58 K1.S1
N$36
  Bottom 0.813: X1.2 16.71,177.96 K1.S2
N$37
  Bottom 0.813: X1.3 17.88,174.16 K2.S1
N$38
  Bottom 0.813: X1.4 15.29,166.53 K2.S2
N$39
  Bottom 0.813: X1.5 16.45,162.72 K3.S1
N$40
  Bottom 0.813: X1.6 13.86,155.1 K3.S2
N$41
  Bottom 0.813: X1.7 15.03,151.29 K4.S1
N$42
  Bottom 0.813: X1.8 12.95,143.68 K4.S2
N$43
  Bottom 0.813: X2.1 13.58,139.87 K5.S1
N$44
  Bottom 0.813: X2.2 14.4,132.25 K5.S2
N$45
  Bottom 0.813: X2.3 13.23,128.44 K6.S1
N$46
  Bottom 0.813: X2.4 15.82,120.81 K6.S2
N$47
  Bottom 0.813: X2.5 14.65,117 K7.S1
N$48
  Bottom 0.813: X2.6 17.24,109.38 K7.S2
N$49
  Bottom 0.813: X2.7 16.07,105.57 K8.S1
N$50
  Bottom 0.813: X2.8 18.66,97.95 K8.S2
N$51
  Bottom 0.813: U$16.K 48.89,184.31 50.16,185.58 R18.1
N$52
  Bottom 0.61: 55.88,87.79 54.6,86.52
  Bottom 0.813: 48.89,87.79 U$8.A | 48.89,87.79 48.89,86.52 | T1.3 55.88,87.79 D2.A 54.6,86.52 50.16,86.52 | 50.16,86.52 47.62,86.52 | 47.62,86.52 K9.16 | 50.16,86.52 48.89,87.79 | 47.62,86.52 48.89,87.79
N$53
  Bottom 0.813: IC7.11 101.98,63.66 103.25,62.39 103.12,36.36 97.15,30.39 IC1.2
N$54  (1 unrouted)
N$55
  Bottom 0.61: 55.88,76.36 54.6,75.09
  Bottom 0.813: 48.89,76.36 48.89,75.09 | T10.3 55.88,76.36 D10.A 54.6,75.09 50.16,75.09 | 50.16,75.09 47.62,75.09 | 47.62,75.09 K10.16 | 48.89,76.36 U$7.A | 50.16,75.09 48.89,76.36 | 47.62,75.09 48.89,76.36
N$56  (1 unrouted)
N$57
  Bottom 0.61: 55.88,64.94 54.6,63.66
  Bottom 0.813: 48.89,64.94 U$6.A | 48.89,64.94 48.89,63.66 | T11.3 55.88,64.94 D16.A 54.6,63.66 50.16,63.66 | 50.16,63.66 47.62,63.66 | 47.62,63.66 K11.16 | 50.16,63.66 48.89,64.94 | 47.62,63.66 48.89,64.94
N$58  (1 unrouted)
N$59
  Bottom 0.813: 59.68,93.51 57.78,92.88 57.14,92.24
N$60
  Bottom 0.61: 55.88,53.5 54.6,52.23
  Bottom 0.813: 48.89,53.5 48.89,52.23 | T12.3 55.88,53.5 D15.A 54.6,52.23 50.16,52.23 | 50.16,52.23 47.62,52.23 | 47.62,52.23 K12.16 | 50.16,52.23 48.89,53.5 | 48.89,53.5 U$5.A | 47.62,52.23 48.89,53.5
N$61  (1 unrouted)
N$62
  Bottom 0.61: 55.88,42.08 54.6,40.8
  Bottom 0.813: T13.3 55.88,42.08 D14.A 54.6,40.8 50.16,40.8 | 50.16,40.8 48.89,40.8 | 48.89,40.8 47.62,40.8 | 47.62,40.8 K13.16 | 48.89,40.8 48.89,42.08 | 48.89,42.08 U$4.A | 50.16,40.8 48.89,42.08 | 48.89,42.08 47.62,40.8
N$63  (1 unrouted)
N$64
  Bottom 0.61: 55.88,30.64 54.6,29.38
  Bottom 0.813: 50.16,29.38 54.6,29.38 D13.A 55.88,30.64 T14.3 | 50.16,29.38 48.89,29.38 | 48.89,29.38 47.62,29.38 | 47.62,29.38 K14.16 | 48.89,29.38 48.89,30.64 | 48.89,30.64 U$3.A | 50.16,29.38 48.89,30.64 | 48.89,30.64 47.62,29.38
N$65  (1 unrouted)
N$66
  Bottom 0.61: 55.88,19.21 54.6,17.94
  Bottom 0.813: 48.89,19.21 U$2.A | 48.89,19.21 48.89,17.94 | T15.3 55.88,19.21 D12.A 54.6,17.94 50.16,17.94 | 50.16,17.94 47.62,17.94 | 47.62,17.94 K15.16 | 50.16,17.94 48.89,19.21 | 47.62,17.94 48.89,19.21
N$67  (1 unrouted)
N$68
  Bottom 0.61: 55.88,7.78 54.6,6.52 | 50.16,6.52 48.89,7.78 47.62,6.52
  Bottom 0.813: U$1.A 48.89,7.78 48.89,6.52 | T16.3 55.88,7.78 D11.A 54.6,6.52 50.16,6.52 47.62,6.52 K16.16
N$69  (1 unrouted)
  Bottom 0.813: IC2.7 84.45,56.68
N$70  (1 unrouted)
N$71  (1 unrouted)
N$72  (1 unrouted)
N$73  (1 unrouted)
N$74  (1 unrouted)
N$75  (1 unrouted)
N$76  (1 unrouted)
N$77
  Bottom 0.813: IC2.6 83.18,54.14 81.91,52.87 81.91,36.99 83.81,35.09 87.62,35.09 95.88,43.34 IC7.19
N$78  (1 unrouted)
N$79  (1 unrouted)
N$80  (1 unrouted)
N$81  (1 unrouted)
N$82  (1 unrouted)
N$83  (1 unrouted)
N$84  (1 unrouted)
N$85  (1 unrouted)
N$86  (1 unrouted)
N$87  (1 unrouted)
N$88  (1 unrouted)
N$89  (1 unrouted)
N$90  (1 unrouted)
N$91  (1 unrouted)
N$92  (1 unrouted)
N$93  (1 unrouted)
N$94
  Bottom 0.813: U$14.K 48.89,161.45 50.16,162.72 R20.1
N$95
  Bottom 0.813: U$15.K 48.89,172.88 50.16,174.16 R19.1
N$96
  Bottom 0.813: U$1.K 48.89,12.86 50.16,14.13 R32.1
N$97  (via drill 1.02)  (2 unrouted)
  Bottom 0.61: 38.09,15.41 39.36,14.13 38.09,12.86 | 38.09,24.3 39.36,25.56 38.09,26.83 | 38.09,35.72 39.36,36.99 38.09,38.27 | 38.09,47.15 39.36,48.42 38.09,49.69 | 38.09,58.58 39.36,59.85 38.09,61.12 | 38.09,70.01 39.36,71.28 38.09,72.55 | 38.09,81.44 39.36,82.72 38.09,83.98 | 39.36,94.14 38.09,92.88 | BUS.15 121.91,62.39 110.48,62.39 109.22,63.66 IC7.10
  Bottom 0.813: 84.45,24.93 84.45,22.39 85.72,21.12 99.05,21.12 107.94,30.01 IC7.1 110.48,40.8 114.93,36.36 IC8.2 114.93,29.38 116.83,27.47 | 39.36,94.14 38.09,94.14 38.09,92.88 38.09,83.98 38.09,82.72 | 39.36,94.14 K9.1 R25.2 | 38.09,82.72 39.36,82.72 K10.1 R26.2 | 38.09,71.28 39.36,71.28 K11.1 R27.2 | 38.09,71.28 38.09,72.55 38.09,81.44 38.09,82.72 | 38.09,59.85 39.36,59.85 K12.1 R28.2 | 38.09,59.85 38.09,61.12 38.09,70.01 38.09,71.28 | 38.09,48.42 39.36,48.42 K13.1 R29.2 | 38.09,48.42 38.09,49.69 38.09,58.58 38.09,59.85 | 38.09,36.99 39.36,36.99 K14.1 R30.2 | 38.09,48.42 38.09,47.15 38.09,38.27 38.09,36.99 | 38.09,25.56 39.36,25.56 K15.1 R31.2 | 38.09,36.99 38.09,35.72 38.09,26.83 38.09,25.56 | 38.09,14.13 39.36,14.13 K16.1 R32.2 | 38.09,25.56 38.09,24.3 38.09,15.41 38.09,14.13 | 38.09,14.13 38.09,12.86 38.09,4.61 39.36,3.34 93.97,3.34 116.83,26.2 | 123.19,57.31 BUS.11 124.45,56.04 | 123.19,57.31 BUS.13 BUS.15 | 124.45,56.04 126.36,56.04 128.26,54.14 128.26,38.27 120.01,29.38 118.1,27.47 | 124.45,56.04 123.19,57.31 | IC3.4 IC3.5 89.53,143.04 90.8,144.31 90.8,148.75 88.89,150.66 IC3.8 86.99,156.38 76.19,167.81 76.19,176.69 73.66,179.24 73.66,187.49 71.75,189.39 47.62,189.39 R18.2 K1.1 39.36,185.58 | 39.36,185.58 38.09,185.58 38.09,184.31 | 38.09,174.16 38.09,175.43 | 38.09,175.43 38.09,184.31 | 38.09,162.72 38.09,164 | 38.09,164 38.09,172.88 | 38.09,172.88 38.09,174.16 | 38.09,151.29 38.09,152.56 | 38.09,152.56 38.09,161.45 | 38.09,161.45 38.09,162.72 | 38.09,141.13 38.09,139.87 | 38.09,150.03 38.09,141.13 | 38.09,151.29 38.09,150.03 | 38.09,139.87 38.09,138.59 | 38.09,138.59 38.09,129.7 | 38.09,129.7 38.09,128.44
  Bottom 0.813: 38.09,128.44 38.09,127.16 | 38.09,127.16 38.09,118.27 | 38.09,118.27 38.09,117 | 38.09,117 38.09,115.73 | 38.09,115.73 38.09,106.84 | 38.09,106.84 38.09,105.57 | 38.09,174.16 39.36,174.16 | 39.36,174.16 K2.1 R19.2 | 38.09,162.72 39.36,162.72 | 39.36,162.72 K3.1 R20.2 | 39.36,151.29 38.09,151.29 | 39.36,151.29 K4.1 R17.2 | 38.09,139.87 39.36,139.87 | 39.36,139.87 K5.1 R21.2 | 38.09,128.44 39.36,128.44 | 39.36,128.44 K6.1 R22.2 | 38.09,117 39.36,117 | 39.36,117 K7.1 R23.2 | 38.09,105.57 39.36,105.57 | 39.36,105.57 K8.1 R24.2 | 38.09,105.57 38.09,104.3 | 38.09,104.3 38.09,95.41 | 38.09,95.41 38.09,93.51 | 38.09,95.41 39.36,94.14 | 39.36,117 38.09,115.73 | 38.09,118.27 39.36,117 | 39.36,105.57 38.09,104.3 | 38.09,106.84 39.36,105.57 | 39.36,128.44 38.09,127.16 | 38.09,129.7 39.36,128.44 | 39.36,139.87 38.09,138.59 | 38.09,141.13 39.36,139.87 | 39.36,151.29 38.09,150.03 | 39.36,151.29 38.09,152.56 | 38.09,161.45 39.36,162.72 | 39.36,162.72 38.09,164 | 38.09,172.88 39.36,174.16 | 39.36,174.16 38.09,175.43 | 38.09,184.31 39.36,185.58 | IC2.5 IC2.4 | v84.45,28.74 IC1.7 | IC2.5 85.08,51.6 84.45,50.96 v84.45,38.27 | IC2.5 88.26,51.6 89.53,52.87 89.53,57.95 88.26,59.22 IC2.8 | 116.83,26.2 117.47,26.83 | 117.47,26.83 118.1,27.47 | 117.47,26.83 116.83,27.47 | 116.83,27.47 118.1,27.47 | 116.83,26.2 116.83,27.47
N$98
  Bottom 0.813: U$13.K 48.89,150.03 50.16,151.29 R17.1
N$109
  Bottom 0.813: 60.95,81.44 57.78,81.44 57.14,80.81
N$111
  Bottom 0.813: 60.95,70.01 57.78,70.01 57.14,69.38
N$113
  Bottom 0.813: 60.95,58.58 57.78,58.58 57.14,57.95
N$115
  Bottom 0.813: 60.95,47.15 57.78,47.15 57.14,46.52
N$117
  Bottom 0.813: 60.95,35.72 57.78,35.72 57.14,35.09
N$119
  Bottom 0.813: 60.95,24.3 57.78,24.3 57.14,23.66
N$121
  Bottom 0.813: 60.95,12.86 57.78,12.86 57.14,12.23
N$123
  Bottom 0.813: 84.45,56.68 83.81,57.31 83.81,61.12 81.91,63.03 78.73,63.03 76.19,65.57 76.19,71.92 73.02,75.09 73.02,83.35 69.84,86.52 69.84,93.51
N$124
  Bottom 0.813: 79.37,59.22 78.1,59.22 73.66,63.66 73.66,71.28 71.11,73.82 71.11,81.44
N$125
  Bottom 0.813: 79.37,56.68 76.83,56.68 71.11,62.39 71.11,70.01
N$126
  Bottom 0.813: 79.37,54.14 75.56,54.14 71.11,58.58
N$127
  Bottom 0.813: 71.11,12.86 71.11,20.48 73.66,23.02 73.66,31.28 76.19,33.82 76.19,41.44 78.73,43.98 79.37,43.98
N$128
  Bottom 0.406: 73.66,42.08 74.29,42.08
  Bottom 0.813: 71.11,24.3 71.11,31.91 73.66,34.45 73.66,42.08 78.1,46.52 79.37,46.52
N$129
  Bottom 0.813: 79.37,49.06 76.83,49.06 71.11,43.34 71.11,35.72
N$130
  Bottom 0.813: 79.37,51.6 75.56,51.6 71.11,47.15
N$131
  Bottom 0.813: 12.69,87.54 19.3,94.14 22.85,94.14
N$132
  Bottom 0.813: 12.69,82.51 16.71,86.52 22.85,86.52
N$133
  Bottom 0.813: 12.69,77.53 17.88,82.72 22.85,82.72
N$134
  Bottom 0.813: 12.69,72.5 15.29,75.09 22.85,75.09
N$135
  Bottom 0.813: 12.69,67.53 16.45,71.28 22.85,71.28
N$136
  Bottom 0.813: 12.69,62.5 13.86,63.66 22.85,63.66
N$137
  Bottom 0.813: 12.69,57.52 15.03,59.85 22.85,59.85
N$138
  Bottom 0.813: 12.69,52.49 12.95,52.23 22.85,52.23
N$139
  Bottom 0.813: 12.69,47.54 13.58,48.42 22.85,48.42
N$140
  Bottom 0.813: 12.69,42.51 14.4,40.8 22.85,40.8
N$141
  Bottom 0.813: 12.69,37.53 13.23,36.99 22.85,36.99
N$142
  Bottom 0.813: 12.69,32.5 15.82,29.38 22.85,29.38
N$143
  Bottom 0.813: 12.69,27.52 14.65,25.56 22.85,25.56
N$144
  Bottom 0.813: 12.69,22.49 17.24,17.94 22.85,17.94
N$145
  Bottom 0.813: 12.69,17.51 16.07,14.13 22.85,14.13
N$146
  Bottom 0.813: 12.69,12.48 18.66,6.52 22.85,6.52
N$148  (1 unrouted)
  Bottom 0.61: 30.47,14.77 31.11,14.13 | 30.47,26.83 31.74,25.56 30.47,24.3 | 30.47,35.72 31.74,36.99 30.47,38.27 | 30.47,47.15 31.74,48.42 30.47,49.69 | 30.47,61.12 31.74,59.85 30.47,58.58 | 30.47,70.01 31.74,71.28 30.47,72.55 | 30.47,106.21 31.11,105.57 | 30.47,118.27 31.74,117 30.47,115.73 | 30.47,127.16 31.74,128.44 30.47,129.7 | 30.47,138.59 31.74,139.87 30.47,141.13 | 30.47,152.56 31.74,151.29 30.47,150.03 | 30.47,161.45 31.74,162.72 30.47,164
  Bottom 0.813: 30.47,59.85 30.47,61.12 30.47,70.01 30.47,71.28 | 30.47,48.42 30.47,49.69 30.47,58.58 30.47,59.85 | 30.47,48.42 30.47,47.15 30.47,38.27 30.47,36.99 | 30.47,36.99 30.47,35.72 30.47,26.83 30.47,25.56 | 30.47,25.56 30.47,24.3 30.47,14.77 30.47,14.13 31.11,14.13 K16.P1 | 30.47,71.28 30.47,72.55 30.47,81.44 | 30.47,82.72 30.47,81.44 | 30.47,94.14 30.47,92.88 | 30.47,92.88 30.47,83.98 | 30.47,83.98 30.47,82.72 | 30.47,82.72 31.74,82.72 | 31.74,82.72 K10.P1 | 30.47,71.28 31.74,71.28 K11.P1 | 30.47,36.99 31.74,36.99 K14.P1 | 30.47,25.56 31.74,25.56 K15.P1 | K13.P1 31.74,48.42 30.47,48.42 | 30.47,59.85 31.74,59.85 K12.P1 | 31.74,82.72 30.47,81.44 | 30.47,83.98 31.74,82.72 | 31.74,94.14 30.47,92.88 | 30.47,151.29 30.47,152.56 30.47,161.45 30.47,162.72 | 30.47,139.87 30.47,141.13 30.47,150.03 30.47,151.29 | 30.47,139.87 30.47,138.59 30.47,129.7 30.47,128.44 | 30.47,128.44 30.47,127.16 30.47,118.27 30.47,117 | 30.47,117 30.47,115.73 30.47,106.84 | 30.47,106.84 30.47,106.21 30.47,105.57 | 30.47,162.72 30.47,164 30.47,174.16 | 30.47,174.16 30.47,185.58 | 30.47,105.57 31.11,105.57 31.74,105.57 | 31.74,105.57 K8.P1 | 30.47,174.16 K2.P1 | 30.47,162.72 31.74,162.72 K3.P1 | 30.47,128.44 31.74,128.44 K6.P1 | 30.47,117 31.74,117 K7.P1 | K5.P1 31.74,139.87 30.47,139.87 | 30.47,151.29 31.74,151.29 K4.P1 | 30.47,104.3 30.47,105.57 | 30.47,104.3 30.47,95.41 | 30.47,95.41 30.47,94.14 | 30.47,94.14 30.47,92.24 | 30.47,94.14 31.74,94.14 | 31.74,94.14 K9.P1 | 30.47,95.41 31.74,94.14 | 31.74,105.57 30.47,104.3 | 30.47,106.84 31.74,105.57 | 30.47,185.58 K1.P1 | 118.1,99.86 111.75,99.86 107.31,104.3 107.31,153.2 79.37,181.14 79.37,188.76 73.66,194.47 36.19,194.47 30.47,188.76 30.47,185.58
N$150
  Bottom 0.813: U$12.K 48.89,138.59 50.16,139.87 R21.1
N$153
  Bottom 0.813: U$11.K 48.89,127.16 50.16,128.44 R22.1
N$156
  Bottom 0.813: U$10.K 48.89,115.73 50.16,117 R23.1
N$160
  Bottom 0.813: U$9.K 48.89,104.3 50.16,105.57 R24.1
N$163
  Bottom 0.813: U$8.K 48.89,92.88 50.16,94.14 R25.1
N$165
  Bottom 0.813: U$7.K 48.89,81.44 50.16,82.72 R26.1
N$169
  Bottom 0.813: U$6.K 48.89,70.01 50.16,71.28 R27.1
N$171
  Bottom 0.813: U$5.K 48.89,58.58 50.16,59.85 R28.1
N$174
  Bottom 0.813: U$4.K 48.89,47.15 50.16,48.42 R29.1
N$177
  Bottom 0.813: U$3.K 48.89,35.72 50.16,36.99 R30.1
N$180
  Bottom 0.813: U$2.K 48.89,24.3 50.16,25.56 R31.1
N$14823  (1 unrouted)
  Bottom 0.61: 35.55,7.78 34.28,6.52 | 35.55,18.58 34.92,17.94 35.55,17.31 | 35.55,28.1 34.28,29.38 35.55,30.64 | 35.55,42.08 34.28,40.8 35.55,39.53 | 35.55,50.96 34.28,52.23 35.55,53.5 | 35.55,62.39 34.28,63.66 35.55,64.94 | 34.28,86.52 35.55,85.25
  Bottom 0.813: 35.55,29.38 34.28,29.38 K14.P2 | 35.55,29.38 35.55,28.1 35.55,18.58 35.55,17.94 | 35.55,17.94 34.92,17.94 K15.P2 | 35.55,17.94 35.55,17.31 35.55,7.78 35.55,6.52 34.28,6.52 K16.P2 | 35.55,40.8 34.28,40.8 K13.P2 | 35.55,40.8 35.55,39.53 35.55,30.64 35.55,29.38 | K12.P2 34.28,52.23 35.55,52.23 | 35.55,52.23 35.55,50.96 35.55,42.08 35.55,40.8 | 35.55,63.66 34.28,63.66 K11.P2 | 35.55,52.23 35.55,53.5 35.55,62.39 35.55,63.66 | 35.55,75.09 K10.P2 | 35.55,63.66 35.55,64.94 35.55,75.09 | 35.55,75.09 35.55,85.25 35.55,86.52 | 35.55,86.52 34.28,86.52 | 34.28,86.52 K9.P2 | 35.55,87.79 35.55,86.52 | 35.55,97.95 34.28,97.95 | 34.28,97.95 K8.P2 | 35.55,155.1 35.55,162.72 | 35.55,155.1 35.55,143.68 | 35.55,143.68 35.55,132.25 | 35.55,132.25 35.55,120.81 | 35.55,120.81 35.55,109.38 | 35.55,109.38 35.55,99.22 | 35.55,99.22 35.55,97.95 | 35.55,162.72 35.55,164 | 35.55,87.79 34.28,86.52 | 35.55,97.95 35.55,96.69 | 35.55,96.69 35.55,87.79 | 34.28,97.95 35.55,96.69 | 35.55,99.22 34.28,97.95 | 35.55,109.38 K7.P2 | 35.55,120.81 K6.P2 | 35.55,132.25 K5.P2 | 35.55,143.68 K4.P2 | 35.55,155.1 K3.P2 | 35.55,162.72 35.55,165.9 | 35.55,165.9 35.55,177.96 | K2.P2 34.92,166.53 35.55,165.9 | 35.55,177.96 K1.P2 | 118.1,94.78 109.22,94.78 104.77,99.86 104.77,151.93 76.83,179.87 76.83,188.12 73.02,191.94 40,191.94 35.55,187.49 35.55,177.96
PB0
  Bottom 0.813: BUS.2 IC7.2
PB1
  Bottom 0.813: BUS.4 IC7.3
PB2
  Bottom 0.813: BUS.6 IC7.4
PB3
  Bottom 0.813: BUS.8 IC7.5
PB4
  Bottom 0.813: BUS.10 IC7.6
PB5
  Bottom 0.813: BUS.12 IC7.7
PB6
  Bottom 0.813: BUS.14 IC7.8
PB7
  Bottom 0.813: IC7.9 109.22,61.12 109.85,60.49 120.01,60.49 BUS.16
(copper drawn outside any net)
  shapes: Bottom circle x8

### Text on the board
Bottom: Chaveam. 16 reles/nov. 2005 | 0 | 1 | 2 | 3 | 4 | 5 | 6 | 7